# Altium schematic sheet Digital_Inputs_24V.SchDoc
size A4; SheetNumber: 8; SheetTotal: 13
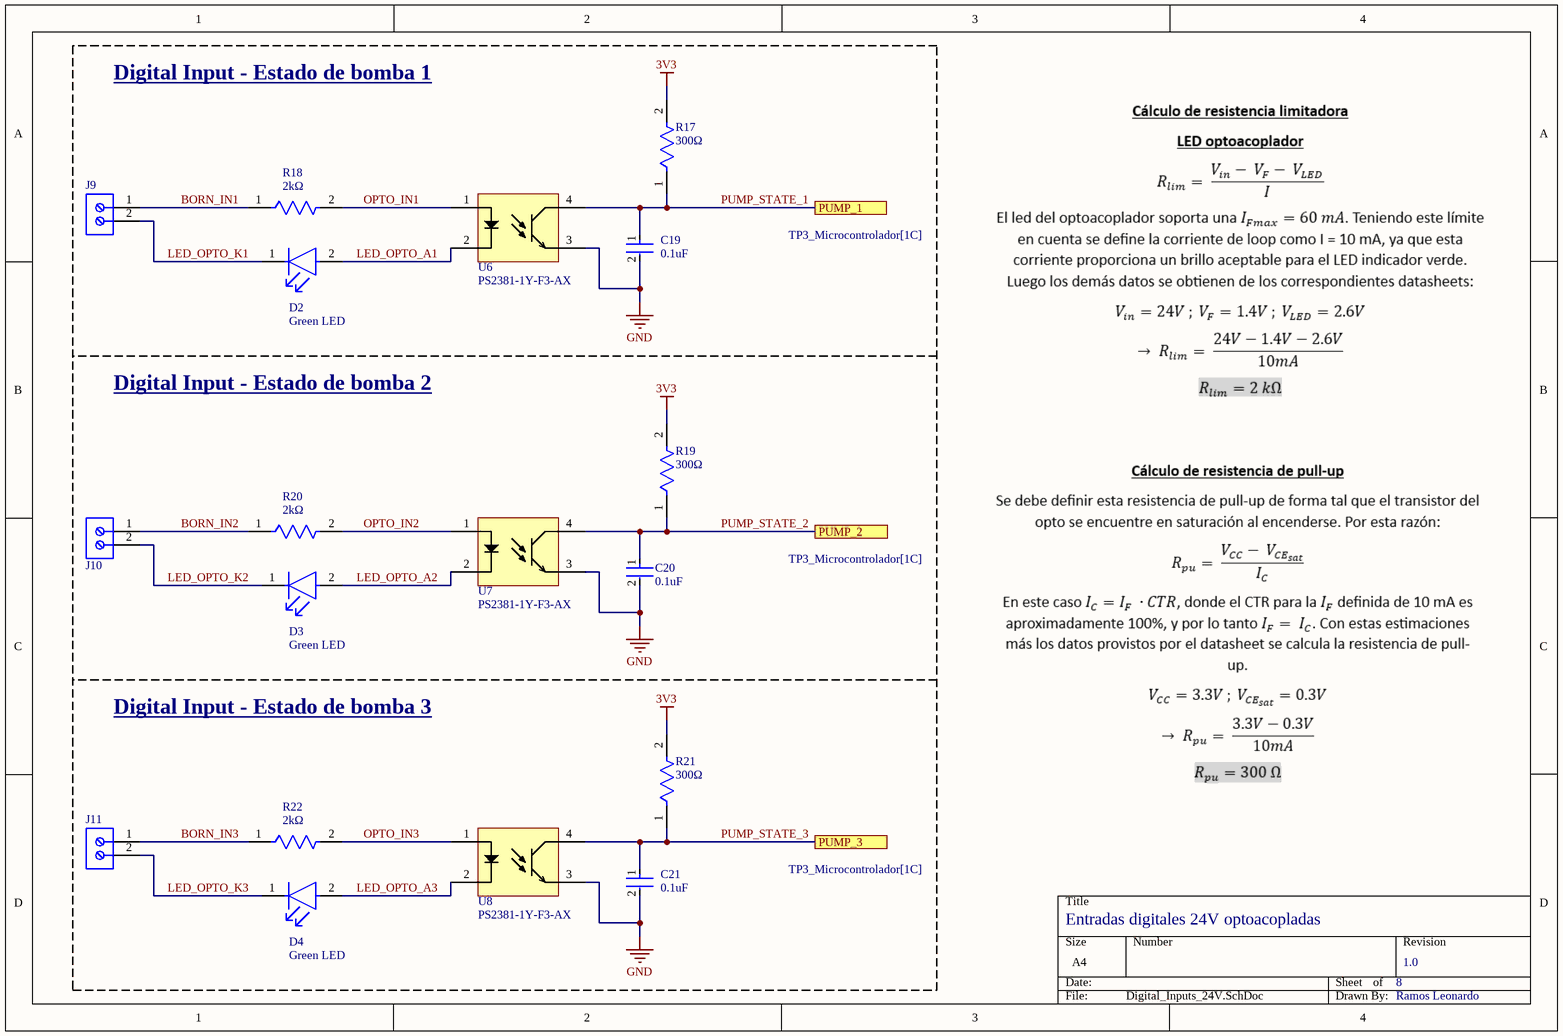
[diagram p0: Digital_Inputs_24V.SchDoc]

## Parts
C19  value 0.1uF  [FP-CC0805-0_85-MFG]  (hidden comment: CC0805KRX7R8BB104)
C20  value 0.1uF  [FP-CC0805-0_85-MFG]  (hidden comment: CC0805KRX7R8BB104)
C21  value 0.1uF  [FP-CC0805-0_85-MFG]  (hidden comment: CC0805KRX7R8BB104)
D2  Green LED  [FP-LTST-C170GKT-MFG]
D3  Green LED  [FP-LTST-C170GKT-MFG]
D4  Green LED  [FP-LTST-C170GKT-MFG]
J9  691137710002  [691137710002]  (value not drawn)
J10  691137710002  [691137710002]  (value not drawn)
J11  691137710002  [691137710002]  (value not drawn)
R17  Resistance: 300Ω  [FP-CRCW0805-e3-IPC_B]  (hidden comment: CRCW08054K70JNEA)
R18  Resistance: 2kΩ  [FP-CRCW0805-e3-IPC_B]  (hidden comment: CRCW08054K70JNEA)
R19  Resistance: 300Ω  [FP-CRCW0805-e3-IPC_B]  (hidden comment: CRCW08054K70JNEA)
R20  Resistance: 2kΩ  [FP-CRCW0805-e3-IPC_B]  (hidden comment: CRCW08054K70JNEA)
R21  Resistance: 300Ω  [FP-CRCW0805-e3-IPC_B]  (hidden comment: CRCW08054K70JNEA)
R22  Resistance: 2kΩ  [FP-CRCW0805-e3-IPC_B]  (hidden comment: CRCW08054K70JNEA)
U6  PS2381-1Y-F3-AX  [LSOP254P1020X230-4N]
U7  PS2381-1Y-F3-AX  [LSOP254P1020X230-4N]
U8  PS2381-1Y-F3-AX  [LSOP254P1020X230-4N]

## Ports
PUMP_1 (see TP3_Microcontrolador[1C]), PUMP_2 (see TP3_Microcontrolador[1C]), PUMP_3 (see TP3_Microcontrolador[1C])

## Nets
3V3: R17.2 R19.2 R21.2
GND: C19.2 C20.2 C21.2 U6.3(Emitter) U7.3(Emitter) U8.3(Emitter)
BORN_IN1: J9.1 R18.1
BORN_IN2: J10.1 R20.1
BORN_IN3: J11.1 R22.1
LED_OPTO_A1: D2.2(A) U6.2(Cathode)
LED_OPTO_A2: D3.2(A) U7.2(Cathode)
LED_OPTO_A3: D4.2(A) U8.2(Cathode)
LED_OPTO_K1: D2.1(C) J9.2
LED_OPTO_K2: D3.1(C) J10.2
LED_OPTO_K3: D4.1(C) J11.2
OPTO_IN1: R18.2 U6.1(Anode)
OPTO_IN2: R20.2 U7.1(Anode)
OPTO_IN3: R22.2 U8.1(Anode)
PUMP_STATE_1: C19.1 R17.1 U6.4(Collector) ; port PUMP_1
PUMP_STATE_2: C20.1 R19.1 U7.4(Collector) ; port PUMP_2
PUMP_STATE_3: C21.1 R21.1 U8.4(Collector) ; port PUMP_3

## Notes on the sheet
- Digital Input - Estado de bomba 1
- Digital Input - Estado de bomba 2
- Digital Input - Estado de bomba 3
- Entradas digitales 24V optoacopladas
- 8
- 1.0
- Ramos Leonardo

## Library data of the parts
C19-C21 = CMP-1036-04410-2: CAP CER 0.1UF 25V X7R 0805; Manufacturer: Yageo; Tolerance: 0.1; Material: Ceramic; Capacitance: 100 nF; ComponentLink2URL: http://www.yageo.com/documents/recent/UPY-GPHC_Y5V_6.3V-to-50V_8.pdf; Category: Cap; Mouser Description: Multilayer Ceramic Capacitors MLCC - SMD/SMT 100nF 25V X7R 10%; Manufacturer Part Number: CC0805KRX7R8BB104; Device Class L1: Passive Components; Footprint Url: http://www.yageo.com/exep/pages/download/literatures/UPY-C_GEN_24.pdf; Height: 0.95mm; Digikey Description: CAP CER 0.1UF 25V X7R 0805; Lead Free: Yes; Temperature Range High: +85°C; Temperature: -30°C to +85°C; Ipc Land Pattern Name: CAPC200125X85; Automotive: No; Octopart: https://octopart.com/cc0805krx7r8bb104-yageo-39467766; Device Class L2: Capacitors; Temperature Characteristic: X7R; Voltage Rating: 25 V; ComponentLink2Description: Datasheet; Temperature Range Low: -30°C; Device Class L3: Ceramic Capacitors; RoHS: TRUE; Package: CC0805-0.85
D2-D4 = CMP-1674-00002-6: LED GREEN CLEAR SMD LTST-C170GKT; Dominant Wavelength: 569nm; Lens Style: Diffused; Forward Voltage: 2.1V; Number of Elements: 1; Wavelength: 565nm; Luminous Intensity: 6mcd; Test Current: 10mA; Power Dissipation: 100mW; Reverse Voltage: 5V; Forward Current: 30mA; Viewing Angle: 130°; Lens Color: Colorless; Min Operating Temperature: -55°C; Number of Pins: 2; Max Operating Temperature: 85°C; Color: Green; Radiation Hardening: No; Illumination Color: Green; Case Code (Metric): 2012; Lens Transparency: Clear; Case/Package: 0805; Width: 1.25mm; Case Code (Imperial): 0805; Package Quantity: 1; Height: 1.1mm; Depth: 1.25mm; Length: 2mm; Power Rating: 100mW; Lead Free: Lead Free; Number of LEDs: 1; Packaging: Tape and Reel; Mount: Surface Mount; Voltage: 5V
J9-J11 = CMP-1502-03324-2: NexarPartId: 78871135; Voltage Rating: 300V; Number of Contacts: 2; Current Rating: 16A; Lead Pitch: 5mm; Height: 11.6mm; Packaging: Box; RoHS: Non-Compliant; Contact Material: Nickel, Tin; Max Operating Temperature: 120°C; Number of Pins: 2; Min Operating Temperature: -30°C; Number of Rows: 1
R17-R19 R21 = CMP-2001-03967-2: RES Thick Film, 5%, 0.125W, 200ppm/°C, 0805; Power Rating: 125mW; Voltage Rating: 150V; Radiation Hardening: No; Case Code (Imperial): 0805; Military Standard: Not; Contact Plating: Tin; Weight: 0.000194oz; Mount: Surface Mount; Termination: SMD/SMT; Packaging: Tape and Reel; Min Operating Temperature: -55°C; Width: 1.25mm; Tolerance: 5%; Height: 0.45mm; Depth: 1.25mm; Length: 2mm; Temperature Coefficient: 200ppm/°C; Case Code (Metric): 2012; Package Quantity: 5000; Max Operating Temperature: 155°C; Case/Package: 0805; Composition: Thick Film
R20 R22 = CMP-2001-03967-2: RES Thick Film, 4.7kΩ, 5%, 0.125W, 200ppm/°C, 0805; Power Rating: 125mW; Voltage Rating: 150V; Radiation Hardening: No; Case Code (Imperial): 0805; Military Standard: Not; Contact Plating: Tin; Weight: 0.000194oz; Mount: Surface Mount; Termination: SMD/SMT; Packaging: Tape and Reel; Min Operating Temperature: -55°C; Width: 1.25mm; Tolerance: 5%; Height: 0.45mm; Depth: 1.25mm; Length: 2mm; Temperature Coefficient: 200ppm/°C; Case Code (Metric): 2012; Package Quantity: 5000; Max Operating Temperature: 155°C; Case/Package: 0805; Composition: Thick Film
U6-U8 = CMP-00572-25656563-1: PS2381-1Y-F3-AX Optocoupler, Transistor, 5Kv, Lsop-4 Rohs Compliant: Yes; Forward Current: 60mA; Reverse Breakdown Voltage: 6V; Collector Emitter Saturation Voltage: 300mV; Forward Voltage: 1.4V; Current Transfer Ratio: 400%; Number of Elements: 1; Collector Emitter Voltage (VCEO): 80V; Power Dissipation: 250mW; Max Operating Temperature: 115°C; Number of Pins: 4; Mount: Surface Mount; NexarPartId: 25656563; Case/Package: SOP; Min Operating Temperature: -40°C; RoHS: Compliant; Packaging: Tape and Reel